# Altium schematic sheet Fujin_Motors.SchDoc
size A4; SheetNumber: 3; SheetTotal: 4
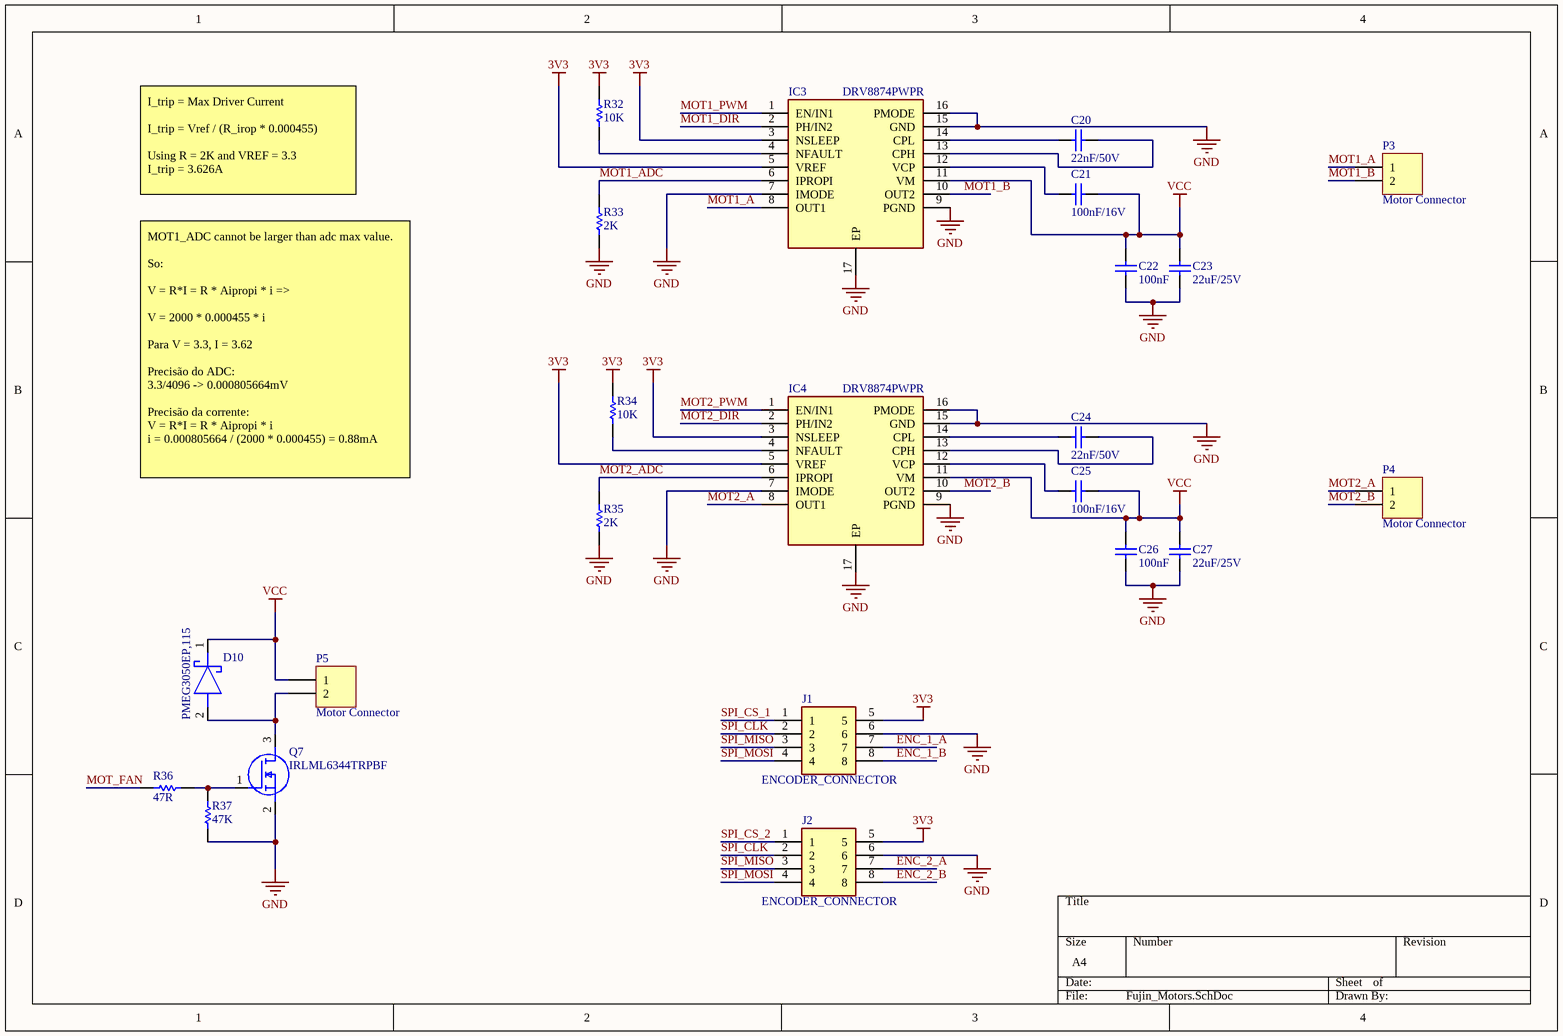
[diagram p0: Fujin_Motors.SchDoc]

## Parts
C20  22nF/50V  [Capacitor-0603]
C21  100nF/16V  [Capacitor-0603]
C22  100nF  [Capacitor-0603]
C23  22uF/25V  [CAPACITOR-0805]
C24  22nF/50V  [Capacitor-0603]
C25  100nF/16V  [Capacitor-0603]
C26  100nF  [Capacitor-0603]
C27  22uF/25V  [CAPACITOR-0805]
D10  PMEG3050EP,115  [PMEG3050EP115]
IC3  DRV8874PWPR  [SOP65P640X120-17N]
IC4  DRV8874PWPR  [SOP65P640X120-17N]
J1  ENCODER_CONNECTOR  [ENCODER_CONN]
J2  ENCODER_CONNECTOR  [ENCODER_CONN]
P3  Motor Connector  [MOTOR_CONNECTOR]
P4  Motor Connector  [MOTOR_CONNECTOR]
P5  Motor Connector  [MOTOR_CONNECTOR]
Q7  IRLML6344TRPBF  [SOT95P237X112-3N]
R32  10K  [RESISTOR 0402]
R33  2K  [RESISTOR 0603]
R34  10K  [RESISTOR 0402]
R35  2K  [RESISTOR 0603]
R36  47R  [RESISTOR 0402]
R37  47K  [RESISTOR 0402]

## Nets
3V3: IC3.3(NSLEEP) IC3.5(VREF) IC4.3(NSLEEP) IC4.5(VREF) J1.5 J2.5 R32.2 R34.2
GND: C22.1 C23.1 C26.1 C27.1 IC3.7(IMODE) IC3.9(PGND) IC3.15(GND) IC3.16(PMODE) IC3.17(EP) IC4.7(IMODE) IC4.9(PGND) IC4.15(GND) IC4.16(PMODE) IC4.17(EP) J1.6 J2.6 Q7.2(S) R33.1 R35.1 R37.1
VCC: C21.2 C22.2 C23.2 C25.2 C26.2 C27.2 D10.1(K) IC3.11(VM) IC4.11(VM) P5.1
ENC_1_A: J1.7
ENC_1_B: J1.8
ENC_2_A: J2.7
ENC_2_B: J2.8
MOT1_A: IC3.8(OUT1) P3.1
MOT1_ADC: IC3.6(IPROPI) R33.2
MOT1_B: IC3.10(OUT2) P3.2
MOT1_DIR: IC3.2(PH/IN2)
MOT1_PWM: IC3.1(EN/IN1)
MOT2_A: IC4.8(OUT1) P4.1
MOT2_ADC: IC4.6(IPROPI) R35.2
MOT2_B: IC4.10(OUT2) P4.2
MOT2_DIR: IC4.2(PH/IN2)
MOT2_PWM: IC4.1(EN/IN1)
MOT_FAN: R36.1
SPI_CLK: J1.2 J2.2
SPI_CS_1: J1.1
SPI_CS_2: J2.1
SPI_MISO: J1.3 J2.3
SPI_MOSI: J1.4 J2.4
NetC20_1: C20.1 IC3.14(CPL)
NetC20_2: C20.2 IC3.13(CPH)
NetC21_1: C21.1 IC3.12(VCP)
NetC24_1: C24.1 IC4.14(CPL)
NetC24_2: C24.2 IC4.13(CPH)
NetC25_1: C25.1 IC4.12(VCP)
NetD10_2: D10.2(A) P5.2 Q7.3(D)
NetIC3_4: IC3.4(NFAULT) R32.1
NetIC4_4: IC4.4(NFAULT) R34.1
NetQ7_1: Q7.1(G) R36.2 R37.2

## Notes on the sheet
- I_trip = Max Driver Current
  I_trip = Vref / (R_irop * 0.000455)
  Using R = 2K and VREF = 3.3
  I_trip = 3.626A
- MOT1_ADC cannot be larger than adc max value.
  So:
  V = R*I = R * Aipropi * i =>
  V = 2000 * 0.000455 * i
  Para V = 3.3, I = 3.62
  Precisão do ADC:
  3.3/4096 -> 0.000805664mV
  Precisão da corrente:
  V = R*I = R * Aipropi * i
  i = 0.000805664 / (2000 * 0.000455) = 0.88mA

## Library data of the parts
C20 C24 = CAP 22nF: Capacitor Cer 22nF 50V; Manufacturer Part Number: IMP14925; Product Range: MCFY Series; Capacitance Tolerance: +80%, -20%; Dielectric Characteristic: Y5; Voltage Rating: 50; Capacitor Terminals: Radial Leaded; SVHC: No SVHC (15-Jun-2015); Supplier 1: Mult Comercial; Manufacturer: -; RoHS: YES; Stock 1: 115809; Pricing 1: 1=0.10 (BRL); Packaging: Each; Lead Spacing: 5; Operating Temperature Min: -25; Operating Temperature Max: 85; Capacitance Tolerance ±: +80%, -20%; Operating Temperature Range: -25°C to +85°C<!--FANDB--><div class="features-and-benefits-container"><div class="features-and-benefits-description"><span class="features-benefits-value">The MCFY series from Multicomp are radial leaded ceramic disc capacitors. The capacitance values ranges from 6800pF to 0.22?F.</span></div><div class="features-and-benefits-list"><ul class="features-and-benefits-list-list"><li class="features-and-benefits-list-item">Large capacitance in small size</li><li class="features-and-benefits-list-item">Rated voltage of 50V</li><li class="features-and-benefits-list-item">80%/-20% tolerance</li><li class="features-and-benefits-list-item">Operating temperature range -25°C to +85; ComponentLink1URL: http://loja.multcomercial.com.br/capacitor-ceramico-disco-100kpf-50v-104-100k-100nf-0-1uf-cod-1351.html; ComponentLink1Description: http://loja.multcomercial.com.br/capacitor-ceramico-disco-100kpf-50v-104-100k-100nf-0-1uf-cod-1351.html; Supplier Part Number 1: Capacitor Cerâmico Disco 100Kpf/50V (104/100K/100nF/0.1uF) cód. 1351
C21 C25 = CAP 100NF 16V: Capacitor Cer 100nF 16VX7R; Manufacturer Part Number: IMP14925; Product Range: MCFY Series; Capacitance: 0.1uF; Capacitance Tolerance: +80%, -20%; Dielectric Characteristic: Y5; Voltage Rating: 50; Capacitor Terminals: Radial Leaded; SVHC: No SVHC (15-Jun-2015); Supplier 1: Mult Comercial; Manufacturer: -; RoHS: YES; Stock 1: 115809; Pricing 1: 1=0.10 (BRL); Packaging: Each; Lead Spacing: 5; Operating Temperature Min: -25; Operating Temperature Max: 85; Capacitance Tolerance ±: +80%, -20%; Operating Temperature Range: -25°C to +85°C<!--FANDB--><div class="features-and-benefits-container"><div class="features-and-benefits-description"><span class="features-benefits-value">The MCFY series from Multicomp are radial leaded ceramic disc capacitors. The capacitance values ranges from 6800pF to 0.22?F.</span></div><div class="features-and-benefits-list"><ul class="features-and-benefits-list-list"><li class="features-and-benefits-list-item">Large capacitance in small size</li><li class="features-and-benefits-list-item">Rated voltage of 50V</li><li class="features-and-benefits-list-item">80%/-20% tolerance</li><li class="features-and-benefits-list-item">Operating temperature range -25°C to +85; ComponentLink1URL: http://loja.multcomercial.com.br/capacitor-ceramico-disco-100kpf-50v-104-100k-100nf-0-1uf-cod-1351.html; ComponentLink1Description: http://loja.multcomercial.com.br/capacitor-ceramico-disco-100kpf-50v-104-100k-100nf-0-1uf-cod-1351.html; Supplier Part Number 1: Capacitor Cerâmico Disco 100Kpf/50V (104/100K/100nF/0.1uF) cód. 1351
C22 C26 = CAP 100NF 50V: Capacitor Cer 100nF 50V; Manufacturer Part Number: IMP14925; Product Range: MCFY Series; Capacitance: 0.1uF; Capacitance Tolerance: +80%, -20%; Dielectric Characteristic: Y5; Voltage Rating: 50; Capacitor Terminals: Radial Leaded; SVHC: No SVHC (15-Jun-2015); Supplier 1: Mult Comercial; Manufacturer: -; RoHS: YES; Stock 1: 115809; Pricing 1: 1=0.10 (BRL); Packaging: Each; Lead Spacing: 5; Operating Temperature Min: -25; Operating Temperature Max: 85; Capacitance Tolerance ±: +80%, -20%; Operating Temperature Range: -25°C to +85°C<!--FANDB--><div class="features-and-benefits-container"><div class="features-and-benefits-description"><span class="features-benefits-value">The MCFY series from Multicomp are radial leaded ceramic disc capacitors. The capacitance values ranges from 6800pF to 0.22?F.</span></div><div class="features-and-benefits-list"><ul class="features-and-benefits-list-list"><li class="features-and-benefits-list-item">Large capacitance in small size</li><li class="features-and-benefits-list-item">Rated voltage of 50V</li><li class="features-and-benefits-list-item">80%/-20% tolerance</li><li class="features-and-benefits-list-item">Operating temperature range -25°C to +85; ComponentLink1URL: http://loja.multcomercial.com.br/capacitor-ceramico-disco-100kpf-50v-104-100k-100nf-0-1uf-cod-1351.html; ComponentLink1Description: http://loja.multcomercial.com.br/capacitor-ceramico-disco-100kpf-50v-104-100k-100nf-0-1uf-cod-1351.html; Supplier Part Number 1: Capacitor Cerâmico Disco 100Kpf/50V (104/100K/100nF/0.1uF) cód. 1351
C23 C27 = CAP CER 22UF 25V X5R 0805: Manufacturer: AVX Corporation; Manufacturer Part Number: 0805YD106KAT2A; Capacitance: 10µF; Tolerance: ±10%; Voltage - Rated: 16V; Supplier 1: Digi-Key; RoHS: RoHS Compliant; Category: Capacitors; Stock 1: 198871; Pricing 1: 1=0.18, 10=0.124, 25=0.0908, 50=0.0742, 100=0.0627, 250=0.05116, 500=0.0429, 1000=0.03795 (USD); Packaging: Cut Tape (CT); Part Status: Active; Temperature Coefficient: X5R; Mounting Type: Surface Mount, MLCC; Operating Temperature: -55°C ~ 85°C; Applications: General Purpose; Ratings: -; Package / Case: 0805 (2012 Metric); Size / Dimension: 0.079" L x 0.049" W (2.01mm x 1.25mm); Height - Seated (Max): -; Thickness (Max): 0.055" (1.40mm); Lead Spacing: -; Features: -; Lead Style: -; ComponentLink1URL: https://www.lcsc.com/product-detail/Multilayer-Ceramic-Capacitors-MLCC-SMD-SMT_Murata-Electronics-GRM21BR61E226ME44L_C86816.html; ComponentLink1Description: http://datasheets.avx.com/cx5r.pdf; Supplier Part Number 1: 478-5165-1-ND
D10 = PMEG3050EP,115: Schottky Diode; Manufacturer_Name: Nexperia; Datasheet Link: https://assets.nexperia.com/documents/data-sheet/PMEG3050EP.pdf; Height: 1mm; Manufacturer_Part_Number: PMEG3050EP,115; Mouser Part Number: 771-PMEG3050EP115; Mouser Price/Stock: https://www.mouser.co.uk/ProductDetail/Nexperia/PMEG3050EP115?qs=GcY6OjH1zdmnjQ%2FhUT5aOA%3D%3D; Arrow Part Number: PMEG3050EP,115; Arrow Price/Stock: https://www.arrow.com/en/products/pmeg3050ep115/nexperia?region=nac
IC3 IC4 = DRV8874PWPR: Integrated Circuit; Manufacturer_Name: Texas Instruments; Datasheet Link: https://www.ti.com/lit/gpn/DRV8874; Height: 1.2mm; Manufacturer_Part_Number: DRV8874PWPR; Mouser Part Number: 595-DRV8874PWPR; Mouser Price/Stock: https://www.mouser.co.uk/ProductDetail/Texas-Instruments/DRV8874PWPR?qs=mAH9sUMRCtvh%2FSU15ywmDA%3D%3D; Arrow Part Number: DRV8874PWPR; Arrow Price/Stock: https://www.arrow.com/en/products/drv8874pwpr/texas-instruments?region=nac
Q7 = IRLML6344TRPBF: MOSFET (N-Channel); Manufacturer_Name: Infineon; Datasheet Link: https://www.infineon.com/dgdl/irlml6344pbf.pdf?fileId=5546d462533600a4015356689c44262c; Height: 1.12mm; Manufacturer_Part_Number: IRLML6344TRPBF; Mouser Part Number: 942-IRLML6344TRPBF; Mouser Price/Stock: https://www.mouser.co.uk/ProductDetail/Infineon-Technologies/IRLML6344TRPBF?qs=9%252BKlkBgLFf2w4qS48UOXVw%3D%3D; Arrow Part Number: IRLML6344TRPBF; Arrow Price/Stock: https://www.arrow.com/en/products/irlml6344trpbf/infineon-technologies-ag?region=europe
R32 R34 = RES 10K 5%: Manufacturer: PANASONIC ELECTRONIC COMPONENTS; Manufacturer Part Number: ERJ-3GEYJ103V; Tolerance: ±5%; Power (Watts): 0.1W, 1/10W; Temperature Coefficient: ±200ppm/°C; RoHS: YES; ComponentLink1URL: http://www.farnell.com/datasheets/1678796.pdf; ComponentLink1Description: http://www.farnell.com/datasheets/1678796.pdf; Category: Resistors; Packaging: Tape & Reel (TR); Resistance (Ohms): 10k; Composition: Thick Film; Features: Automotive AEC-Q200; Operating Temperature: -55°C ~ 155°C; Package / Case: 0603 (1608 Metric); Supplier Device Package: 0603; Size / Dimension: 0.063" L x 0.031" W (1.60mm x 0.80mm); Height: 0.022" (0.55mm); Number of Terminations: 2; ComponentLink2URL: http://industrial.panasonic.com/www-cgi/jvcr13pz.cgi?E+PZ+3+AOA0001+ERJ3GEYJ103V+7+WW; ComponentLink2Description: http://industrial.panasonic.com/www-cgi/jvcr13pz.cgi?E+PZ+3+AOA0001+ERJ3GEYJ103V+7+WW
R33 R35 = RES 2K 1%_1: Resistor 2K 1% tolerance; Manufacturer: Ty-Ohm; Manufacturer Part Number: CR25; Tolerance: ±5%; Power (Watts): 0.25W, 1/4W; Temperature Coefficient: 0/ -500ppm/°C; Supplier 1: Mult Comercial; RoHS: RoHS Compliant; Category: Resistors; Stock 1: 617543; Pricing 1: 1=0.20 (BRL); Packaging: Cut Tape (CT); Composition: Carbon Film; Features: Flame Retardant Coating, Safety; Operating Temperature: -55°C ~ 155°C; Package / Case: Axial; Supplier Device Package: Axial; Size / Dimension: 0.091" Dia x 0.256" L (2.30mm x 6.50mm); Height: -; Number of Terminations: 2; ComponentLink1URL: http://loja.multcomercial.com.br/resistor-de-1-4-de-watt-cr25-5-de-tolerancia.html; ComponentLink1Description: http://loja.multcomercial.com.br/resistor-de-1-4-de-watt-cr25-5-de-tolerancia.html; Supplier Part Number 1: Resistor de Filme de Carbono 1/4 de Watt CR25 5% de tolerância - 0.22R Ω à 10M Ω; Resistance (Ohms): ?
R36 = RES 47R 5%: Manufacturer: Ty-Ohm; Manufacturer Part Number: CR25; Tolerance: ±5%; Power (Watts): 0.25W, 1/4W; Temperature Coefficient: 0/ -500ppm/°C; Resistance (Ohms): 470R; Supplier 1: Mult Comercial; RoHS: RoHS Compliant; Category: Resistors; Stock 1: 617543; Pricing 1: 1=0.20 (BRL); Packaging: Cut Tape (CT); Composition: Carbon Film; Features: Flame Retardant Coating, Safety; Operating Temperature: -55°C ~ 155°C; Package / Case: Axial; Supplier Device Package: Axial; Size / Dimension: 0.091" Dia x 0.256" L (2.30mm x 6.50mm); Height: -; Number of Terminations: 2; ComponentLink1URL: http://loja.multcomercial.com.br/resistor-de-1-4-de-watt-cr25-5-de-tolerancia.html; ComponentLink1Description: http://loja.multcomercial.com.br/resistor-de-1-4-de-watt-cr25-5-de-tolerancia.html; Supplier Part Number 1: Resistor de Filme de Carbono 1/4 de Watt CR25 5% de tolerância - 0.22R Ω à 10M Ω
R37 = RES 47K 5%: Manufacturer: Ty-Ohm; Manufacturer Part Number: CR25; Tolerance: ±5%; Power (Watts): 0.25W, 1/4W; Temperature Coefficient: 0/ -500ppm/°C; Supplier 1: Mult Comercial; RoHS: RoHS Compliant; Category: Resistors; Stock 1: 617543; Pricing 1: 1=0.20 (BRL); Packaging: Cut Tape (CT); Composition: Carbon Film; Features: Flame Retardant Coating, Safety; Operating Temperature: -55°C ~ 155°C; Package / Case: Axial; Supplier Device Package: Axial; Size / Dimension: 0.091" Dia x 0.256" L (2.30mm x 6.50mm); Height: -; Number of Terminations: 2; ComponentLink1URL: http://loja.multcomercial.com.br/resistor-de-1-4-de-watt-cr25-5-de-tolerancia.html; ComponentLink1Description: http://loja.multcomercial.com.br/resistor-de-1-4-de-watt-cr25-5-de-tolerancia.html; Supplier Part Number 1: Resistor de Filme de Carbono 1/4 de Watt CR25 5% de tolerância - 0.22R Ω à 10M Ω